# Altium schematic sheet ALU_OR.SchDoc
size B; Author: E. Sims; Organization: Let's Build Rockets Inc.; SheetNumber: 13; SheetTotal: 16
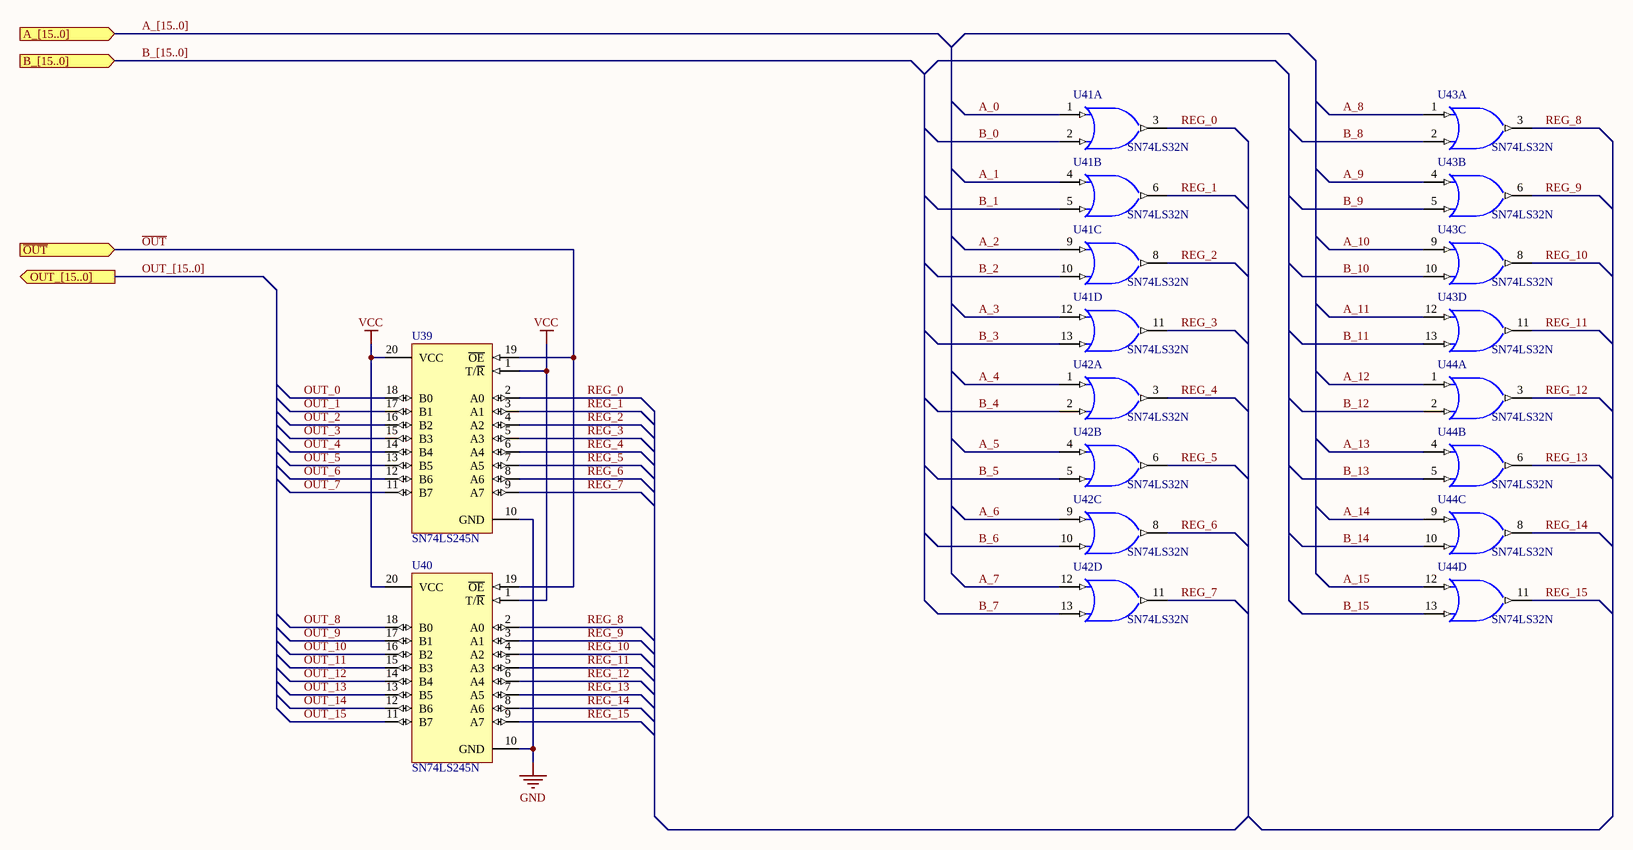
[diagram p0: ALU_OR.SchDoc]

## Parts
U39  SN74LS245N  [N020]
U40  SN74LS245N  [N020]
U41  SN74LS32N  [N014]  (parts A,B,C,D of 4)
U42  SN74LS32N  [N014]  (parts A,B,C,D of 4)
U43  SN74LS32N  [N014]  (parts A,B,C,D of 4)
U44  SN74LS32N  [N014]  (parts A,B,C,D of 4)

## Ports
A_[15..0] (in), B_[15..0] (in), OUT_[15..0] (out), ~{OUT} (in)

## Nets
GND: U39.10(GND) U40.10(GND) U41.7(GND) U42.7(GND) U43.7(GND) U44.7(GND)
VCC: U39.1(T/~{R}) U39.20(VCC) U40.1(T/~{R}) U40.20(VCC) U41.14(VCC) U42.14(VCC) U43.14(VCC) U44.14(VCC)
A_0: U41.1(A)
A_1: U41.4(A)
A_2: U41.9(A)
A_3: U41.12(A)
A_4: U42.1(A)
A_5: U42.4(A)
A_6: U42.9(A)
A_7: U42.12(A)
A_8: U43.1(A)
A_9: U43.4(A)
A_10: U43.9(A)
A_11: U43.12(A)
A_12: U44.1(A)
A_13: U44.4(A)
A_14: U44.9(A)
A_15: U44.12(A)
B_0: U41.2(B)
B_1: U41.5(B)
B_2: U41.10(B)
B_3: U41.13(B)
B_4: U42.2(B)
B_5: U42.5(B)
B_6: U42.10(B)
B_7: U42.13(B)
B_8: U43.2(B)
B_9: U43.5(B)
B_10: U43.10(B)
B_11: U43.13(B)
B_12: U44.2(B)
B_13: U44.5(B)
B_14: U44.10(B)
B_15: U44.13(B)
~{OUT}: U39.19(~{OE}) U40.19(~{OE}) ; port ~{OUT}
OUT_0: U39.18(B0)
OUT_1: U39.17(B1)
OUT_2: U39.16(B2)
OUT_3: U39.15(B3)
OUT_4: U39.14(B4)
OUT_5: U39.13(B5)
OUT_6: U39.12(B6)
OUT_7: U39.11(B7)
OUT_8: U40.18(B0)
OUT_9: U40.17(B1)
OUT_10: U40.16(B2)
OUT_11: U40.15(B3)
OUT_12: U40.14(B4)
OUT_13: U40.13(B5)
OUT_14: U40.12(B6)
OUT_15: U40.11(B7)
REG_0: U39.2(A0) U41.3(Y)
REG_1: U39.3(A1) U41.6(Y)
REG_2: U39.4(A2) U41.8(Y)
REG_3: U39.5(A3) U41.11(Y)
REG_4: U39.6(A4) U42.3(Y)
REG_5: U39.7(A5) U42.6(Y)
REG_6: U39.8(A6) U42.8(Y)
REG_7: U39.9(A7) U42.11(Y)
REG_8: U40.2(A0) U43.3(Y)
REG_9: U40.3(A1) U43.6(Y)
REG_10: U40.4(A2) U43.8(Y)
REG_11: U40.5(A3) U43.11(Y)
REG_12: U40.6(A4) U44.3(Y)
REG_13: U40.7(A5) U44.6(Y)
REG_14: U40.8(A6) U44.8(Y)
REG_15: U40.9(A7) U44.11(Y)

## Buses and harness runs
bus A_[15..0] = port A_[15..0]
bus B_[15..0] = port B_[15..0]
bus OUT_[15..0] = port OUT_[15..0]

## Notes on the sheet
- Let's Build Rocket's Inc. Modular Paylaod System Based on TMP-010 Rev
  For more information visit https://github.com/LetsBuildRockets/Modular-Payload-System
  This work is licensed under CC BY-NC 4.0. To view a copy of this license, visit https://creativecommons.org/licenses/by-nc/4.0
- Title
- Size:
- Date:
- Assembly Variant:
- B
- Number:
- Time:
- Revision:
- Sheet
- of
- Author:
- File:

## Library data of the parts
U39 U40 = SN74LS245N: Octal Bus Transceiver with 3-State Outputs; Published: 8-Jun-2000; LatestRevisionDate: 04-Mar-2005; LatestRevisionNote: Stylized 3D Model Added.; DatasheetVersion: Mar-1988; PackageVersion: Oct-1995; PackageReference: N020; Publisher: Altium Limited; PackageDescription: DIP; 20 Leads; Row Spacing 7.62 mm; Pitch 2.54 mm; ComponentLink1Description: Manufacturer Link; ComponentLink1URL: http://www.ti.com/; ComponentLink2Description: Datasheet; ComponentLink2URL: http://www-s.ti.com/sc/ds/sn74ls245.pdf
U41-U44 = SN74LS32N: Quadruple 2-Input Positive-OR Gate; Published: 8-Jun-2000; LatestRevisionDate: 04-Mar-2005; LatestRevisionNote: Stylized 3D Model Added.; DatasheetVersion: Mar-1988; PackageVersion: Oct-1995; PackageReference: N014; Publisher: Altium Limited; PackageDescription: DIP; 14 Leads; Row Spacing 7.62 mm; Pitch 2.54 mm; ComponentLink1Description: Manufacturer Link; ComponentLink1URL: http://www.ti.com/; ComponentLink2Description: Datasheet; ComponentLink2URL: http://www-s.ti.com/sc/ds/sn74ls32.pdf